# EAGLE design homecontroller_addon_PT1000 (EAGLE 6.6.0)
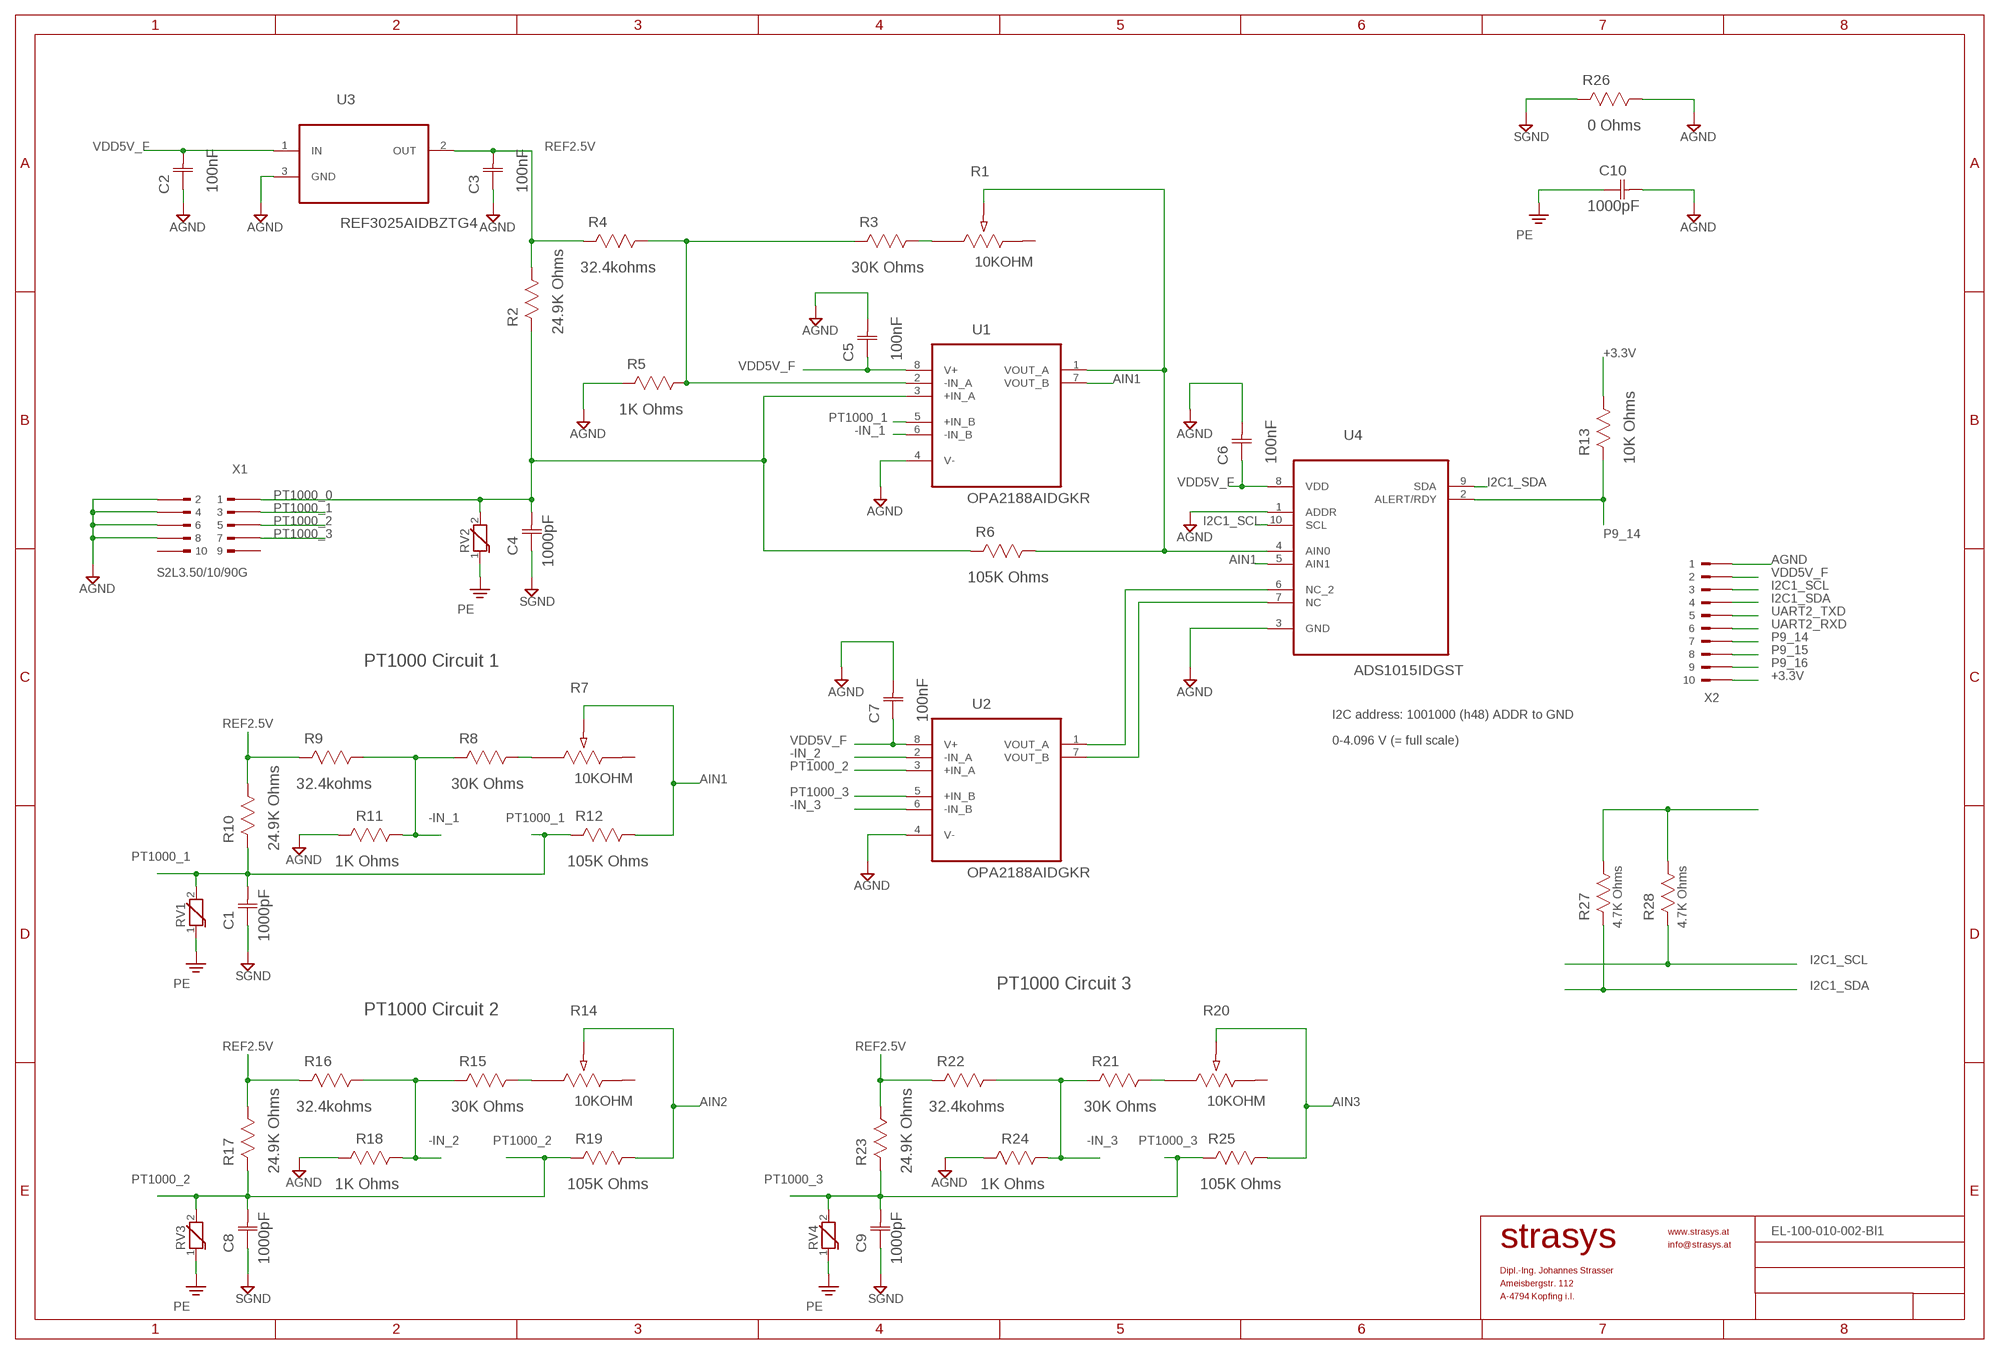
[diagram p0: schematic, sheet 1]
FRAME1 (STRASYS_DINA3_L): DATE_DRAWING: 02.09.2015 / STJO; DRAWING_NAME1: Home Controller; DRAWING_NAME2: PT1000 add on board; DRAWING_NO: EL-100-010-002-Bl1; PAGE: 1

## Parts
C1  1000pF  C1206C102KDRACTU  [CAPC3216X88N]
C2  100nF  C0805C104K5RACTU  [CAPC2013X110N]
C3  100nF  C0805C104K5RACTU  [CAPC2013X110N]
C4  1000pF  C1206C102KDRACTU  [CAPC3216X88N]
C5  100nF  C0805C104K5RACTU  [CAPC2013X110N]
C6  100nF  C0805C104K5RACTU  [CAPC2013X110N]
C7  100nF  C0805C104K5RACTU  [CAPC2013X110N]
C8  1000pF  C1206C102KDRACTU  [CAPC3216X88N]
C9  1000pF  C1206C102KDRACTU  [CAPC3216X88N]
C10  1000pF  C1206C102KDRACTU  [CAPC3216X88N]
R1  10KOHM  EVM3YSX50B14-3W  [POT_EVM3W]
R2  24.9K Ohms  CRCW080524K9FKEA  [RESC2013X65N]
R3  30K Ohms  CRCW080530K0FKEA  [RESC2013X65N]
R4  32.4kohms  ERJ6ENF3242V  [RESC2013X65N]
R5  1K Ohms  CRCW08051K00FKEA  [RESC2013X65N]
R6  105K Ohms  CRCW0805105KFKEA  [RESC2013X65N]
R7  10KOHM  EVM3YSX50B14-3W  [POT_EVM3W]
R8  30K Ohms  CRCW080530K0FKEA  [RESC2013X65N]
R9  32.4kohms  ERJ6ENF3242V  [RESC2013X65N]
R10  24.9K Ohms  CRCW080524K9FKEA  [RESC2013X65N]
R11  1K Ohms  CRCW08051K00FKEA  [RESC2013X65N]
R12  105K Ohms  CRCW0805105KFKEA  [RESC2013X65N]
R13  10K Ohms  CRCW080510K0JNEA  [RESC2013X65N]
R14  10KOHM  EVM3YSX50B14-3W  [POT_EVM3W]
R15  30K Ohms  CRCW080530K0FKEA  [RESC2013X65N]
R16  32.4kohms  ERJ6ENF3242V  [RESC2013X65N]
R17  24.9K Ohms  CRCW080524K9FKEA  [RESC2013X65N]
R18  1K Ohms  CRCW08051K00FKEA  [RESC2013X65N]
R19  105K Ohms  CRCW0805105KFKEA  [RESC2013X65N]
R20  10KOHM  EVM3YSX50B14-3W  [POT_EVM3W]
R21  30K Ohms  CRCW080530K0FKEA  [RESC2013X65N]
R22  32.4kohms  ERJ6ENF3242V  [RESC2013X65N]
R23  24.9K Ohms  CRCW080524K9FKEA  [RESC2013X65N]
R24  1K Ohms  CRCW08051K00FKEA  [RESC2013X65N]
R25  105K Ohms  CRCW0805105KFKEA  [RESC2013X65N]
R26  0 Ohms  CRCW12060000Z0EA  [RESC3216X71N]
R27  4.7K Ohms  CRCW08054K70FKEA  [RESC2013X65N]
R28  4.7K Ohms  CRCW08054K70FKEA  [RESC2013X65N]
RV1  MC-VZ-MCVZ0805M180AGT_0805  [WESURGE_0805]
RV2  MC-VZ-MCVZ0805M180AGT_0805  [WESURGE_0805]
RV3  MC-VZ-MCVZ0805M180AGT_0805  [WESURGE_0805]
RV4  MC-VZ-MCVZ0805M180AGT_0805  [WESURGE_0805]
U1  OPA2188AIDGKR  [SOP65P490X110-8N]
U2  OPA2188AIDGKR  [SOP65P490X110-8N]
U3  REF3025AIDBZTG4  [SOT95P237X112-3N]
U4  ADS1015IDGST  [SOP50P490X110-10N]
X1  S2L3.50/10/90G  [S2L-90G-10]
X2  CON-10X2MM  [2MM-10-THT]

## Nets
+3.3V: R13.1 R27.1 R28.1 X2.P$10
-IN_0: R3.2 R4.1 R5.1 U1.2(-IN_A)
-IN_1: R8.2 R9.1 R11.1 U1.6(-IN_B)
-IN_2: R15.2 R16.1 R18.1 U2.2(-IN_A)
-IN_3: R21.2 R22.1 R24.1 U2.6(-IN_B)
AGND: C2.1(C1) C3.1(C1) C5.2(C2) C6.2(C2) C7.2(C2) C10.2(C2) R5.2 R11.2 R18.2 R24.2 R26.1 U1.4(V-) U2.4(V-) U3.3(GND) U4.1(ADDR) U4.3(GND) X1.2 X1.4 X1.6 X1.8 X2.P$1
AIN0: R1.2 R6.1 U1.1(VOUT_A) U4.4(AIN0)
AIN1: R7.2 R12.1 U1.7(VOUT_B) U4.5(AIN1)
AIN2: R14.2 R19.1 U2.1(VOUT_A) U4.6(NC_2)
AIN3: R20.2 R25.1 U2.7(VOUT_B) U4.7(NC)
I2C1_SCL: R28.2 U4.10(SCL) X2.P$3
I2C1_SDA: R27.2 U4.9(SDA) X2.P$4
N$2: R14.1 R15.1
N$3: R7.1 R8.1
N$4: R20.1 R21.1
N$6: R1.1 R3.1
P9_14: R13.2 U4.2(ALERT/RDY) X2.P$7
P9_15: X2.P$8
P9_16: X2.P$9
PE: C10.1(C1) RV1.1 RV2.1 RV3.1 RV4.1
PT1000_0: C4.2(C2) R2.2 R6.2 RV2.2 U1.3(+IN_A) X1.1
PT1000_1: C1.2(C2) R10.2 R12.2 RV1.2 U1.5(+IN_B) X1.3
PT1000_2: C8.2(C2) R17.2 R19.2 RV3.2 U2.3(+IN_A) X1.5
PT1000_3: C9.2(C2) R23.2 R25.2 RV4.2 U2.5(+IN_B) X1.7
REF2.5V: C3.2(C2) R2.1 R4.2 R9.2 R10.1 R16.2 R17.1 R22.2 R23.1 U3.2(OUT)
SGND: C1.1(C1) C4.1(C1) C8.1(C1) C9.1(C1) R26.2
UART2_RXD: X2.P$6
UART2_TXD: X2.P$5
VDD5V_F: C2.2(C2) C5.1(C1) C6.1(C1) C7.1(C1) U1.8(V+) U2.8(V+) U3.1(IN) U4.8(VDD) X2.P$2
Unconnected: R1.3 R7.3 R14.3 R20.3 X1.9 X1.10

## Notes on the sheet
- PT1000 Circuit 1
- I2C address: 1001000 (h48) ADDR to GND
- 0-4.096 V (= full scale)
- PT1000 Circuit 3
- PT1000 Circuit 2

## Library data of the parts
C1 C4 C8-C10 = supply2:C1206C102KDRACTU: Capacitor 1206; MF: KEMET; MPN: C1206C102KDRACTU; OC_FARNELL: 1826304; SUPPLIER: Kemet; TOLERANCE: +/- 10%; VOLTAGE_RATING: 1000V
C2 C3 C5-C7 = Kemet_By_element14_1:C0805C104K5RACTU: CAPACITOR, 0805; MF: KEMET; MPN: C0805C104K5RACTU; OC_FARNELL: 1414664; OC_NEWARK: 65H7431; SUPPLIER: Kemet; TOLERANCE: ±10%; VOLTAGERATING: 50V
R1 R7 R14 R20 = Panasonic-Trimmer_Potentiometers:EVM: Potentiometers; MF: PANASONIC ELECTRONIC COMPONENTS; MPN: EVM3YSX50B14; OC_FARNELL: 1849801; OC_NEWARK: 48W0124; PACKAGE: EVM3Y; POWERRATING: 0.15W; SUPPLIER: PANASONIC; TOLERANCE: ±25 %
R2 R10 R17 R23 = Vishay_By_element14_Batch_1:CRCW080524K9FKEA: RESISTOR, 0805; MF: VISHAY DRALORIC; MPN: CRCW080524K9FKEA; OC_FARNELL: 1469901; OC_NEWARK: 53K0043; SUPPLIER: Vishay; TOLERANCE: ±1%; WATTAGE: 0.125 W
R3 R8 R15 R21 = Vishay_By_element14_Batch_1:CRCW080530K0FKEA: RESISTOR, 0805; MF: VISHAY DRALORIC; MPN: CRCW080530K0FKEA; OC_FARNELL: 1469914; OC_NEWARK: 53K0136; SUPPLIER: Vishay; TOLERANCE: ±1%; WATTAGE: 0.125 W
R4 R9 R16 R22 = Vishay_By_element14_Batch_1:ERJ6ENF3242V: RESISTOR, 0805; MF: PANASONIC ELECTRONIC COMPONENTS; MPN: ERJ6ENF3242V; OC_FARNELL: 2303704; SUPPLIER: PANASONIC ELECTRONIC COMPONENTS; TOLERANCE: +/- 1%; WATTAGE: 0.125 W
R5 R11 R18 R24 = Vishay_By_element14_Batch_1:CRCW08051K00FKEA: RESISTOR, 0805; MF: VISHAY DRALORIC; MPN: CRCW08051K00FKEA; OC_FARNELL: 1469847; OC_NEWARK: 52K9723; SUPPLIER: Vishay; TOLERANCE: ±1%; WATTAGE: 0.125 W
R6 R12 R19 R25 = Vishay_By_element14_Batch_1:CRCW0805105KFKEA: RESISTOR, 0805; MF: VISHAY DRALORIC; MPN: CRCW0805105KFKEA; OC_FARNELL: 1652908; OC_NEWARK: 52K9813; SUPPLIER: Vishay; TOLERANCE: ±1%; WATTAGE: 0.125 W
R13 = Vishay_By_element14_Batch_1:CRCW080510K0JNEA: RESISTOR, 0805; MF: VISHAY DRALORIC; MPN: CRCW080510K0JNEA; OC_FARNELL: 1469857; OC_NEWARK: 52K9797; SUPPLIER: Vishay; TOLERANCE: ±5%; WATTAGE: 0.125 W
R26 = Vishay_By_element14_Batch_1:CRCW12060000Z0EA: RESISTOR, 1206; MF: VISHAY DRALORIC; MPN: CRCW12060000Z0EA; OC_FARNELL: 1469963; OC_NEWARK: 53K1778; SUPPLIER: Vishay; TOLERANCE: -; WATTAGE: 0.25W
R27 R28 = Vishay_By_element14_Batch_1:CRCW08054K70FKEA: RESISTOR, 0805; MPN: CRCW08054K70FKEA; OC_FARNELL: 1469923; OC_NEWARK: 53K0215; SUPPLIER: Vishay; TOLERANCE: ±1%; WATTAGE: 0.125 W
RV1-RV4 = WE-VS:MC-VZ: SMD Varistor ESD Protection for components sensitive to IEC 61000-4-2, Provides Circuit Board Transient Voltage Protection for Transistors Protection of Video and Audio Ports; MF: MULTICOMP; MPN: MCVZ0805M180AGT; OC_FARNELL: 1856938; PACKAGE: 0805; SUPPLIER: MULTICOMP
U1 U2 = strasys_standard:OPA2188AIDGKR: OP AMP, GP, RR, 2MHZ, 36-V, Zero-Drift,8MSOP; MF: TEXAS INSTRUMENTS; MPN: OPA2188AIDGKR; OC_FARNELL: 2057091; OC_NEWARK: 61T5955; PACKAGE: 8MSOP; SUPPLIER: TEXAS INSTRUMENTS
U3 = strasys_standard:REF3025AIDBZTG4: CMOS VOLTAGE REFERENCE; MF: TEXAS INSTRUMENTS; MPN: REF3025AIDBZTG4; OC_FARNELL: 1234684; OC_NEWARK: 13M5187; PACKAGE: SOT-23-3; SUPPLIER: TEXAS INSTRUMENTS
U4 = ADS1015:ADS1015IDGST: Ultra-Small, Low-Power, 12-Bit Analog-to-Digital Converter with Internal Reference; MF: TEXAS INSTRUMENTS; MPN: ADS1015IDGST; OC_FARNELL: 1778211; OC_NEWARK: 35R0211; PACKAGE: MSOP-10; SUPPLIER: Texas Instruments
X1 = strasys_standard:S2L3.50/10/90G: OMNIMATE S2L3.50/10/90G Fa. Weidmüller; OC_FARNELL: unknown; SUPPLIER: Weidmüller
X2 = strasys_standard:CON-10X2MM: THT pin connector male pitch: 2mm; OC_FARNELL: unknown

## Net classes
0 default: clearance 0.205 mm

## Board
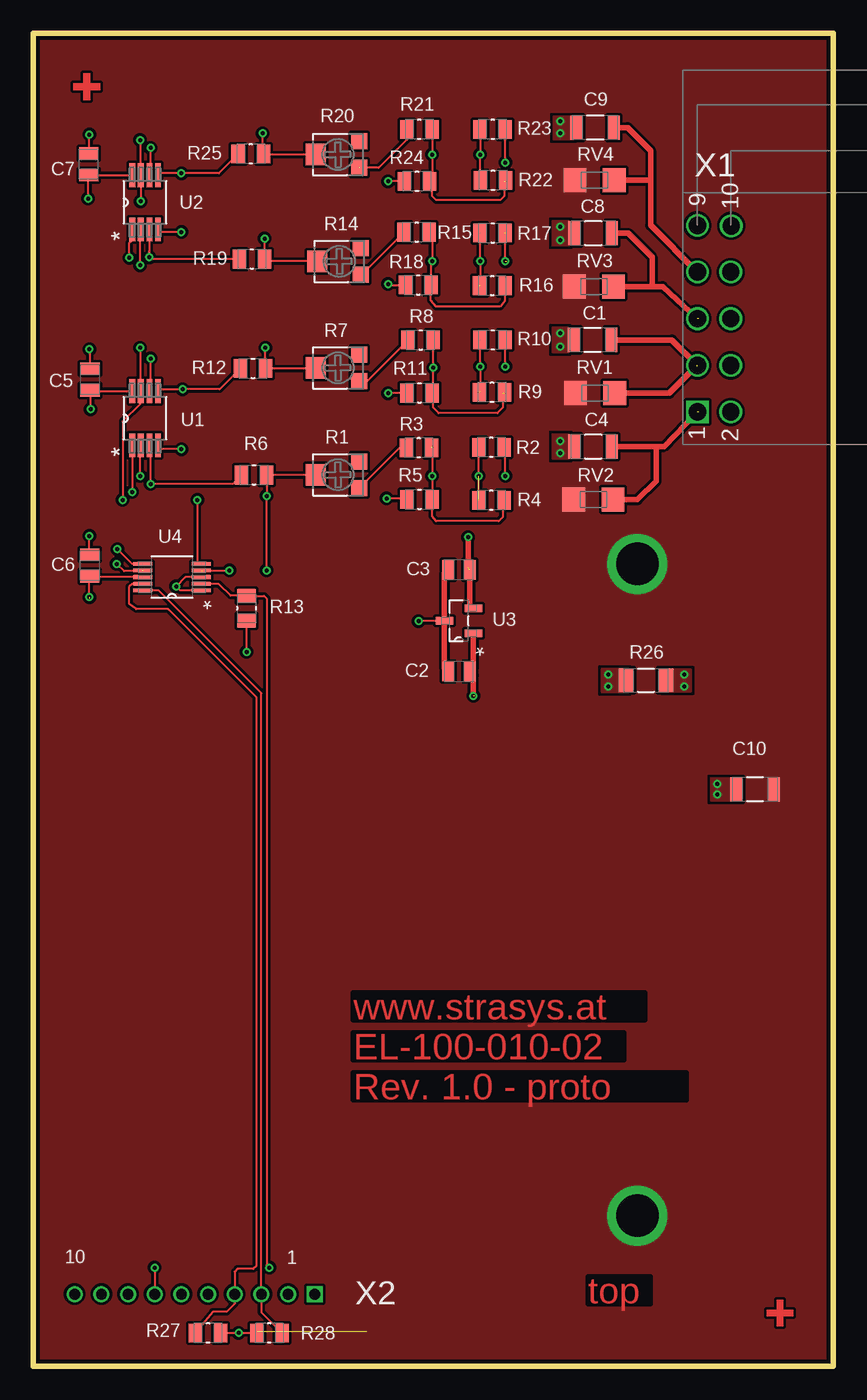
[diagram p1: board, top side]
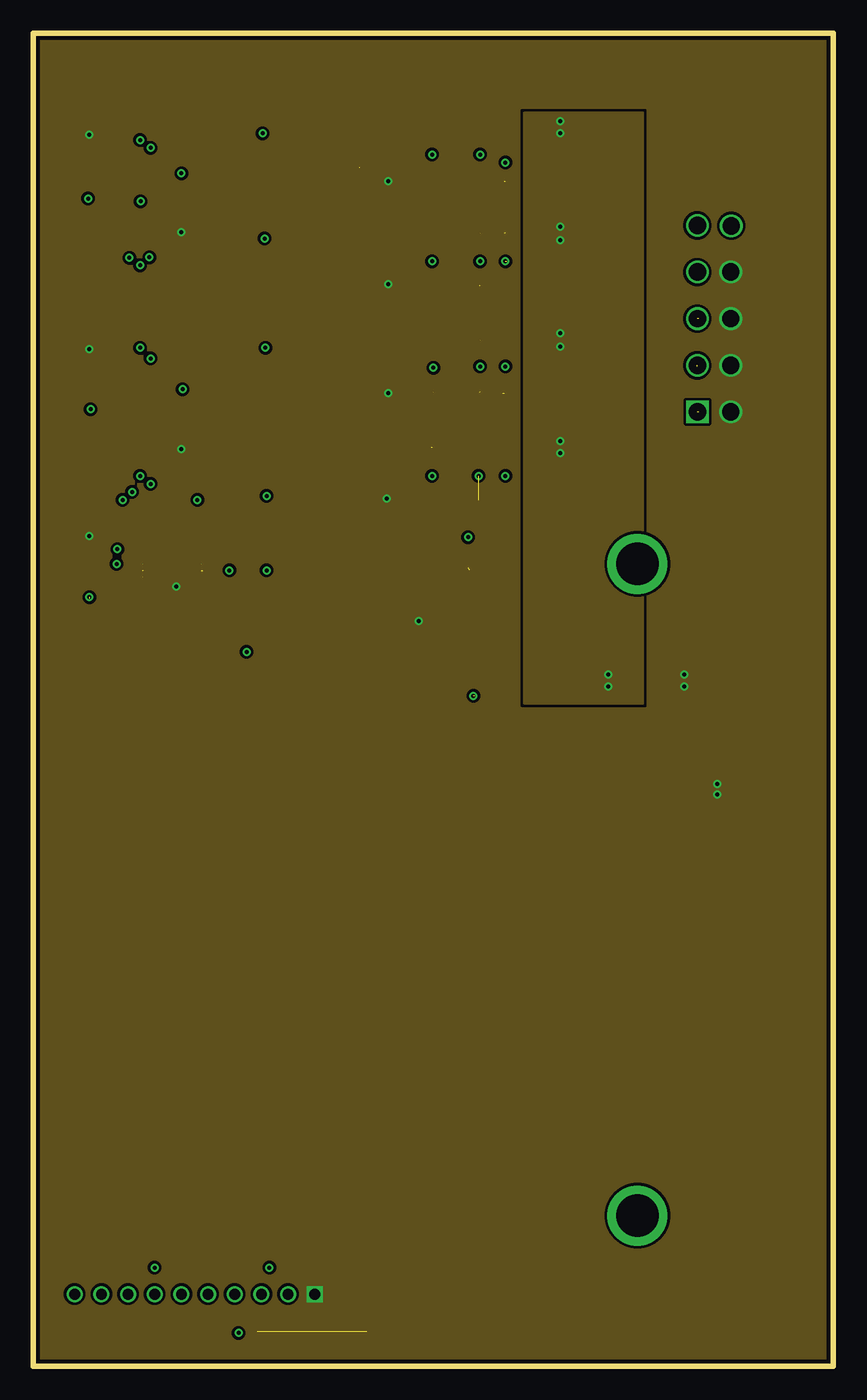
[diagram p2: board, inner layer Route2]
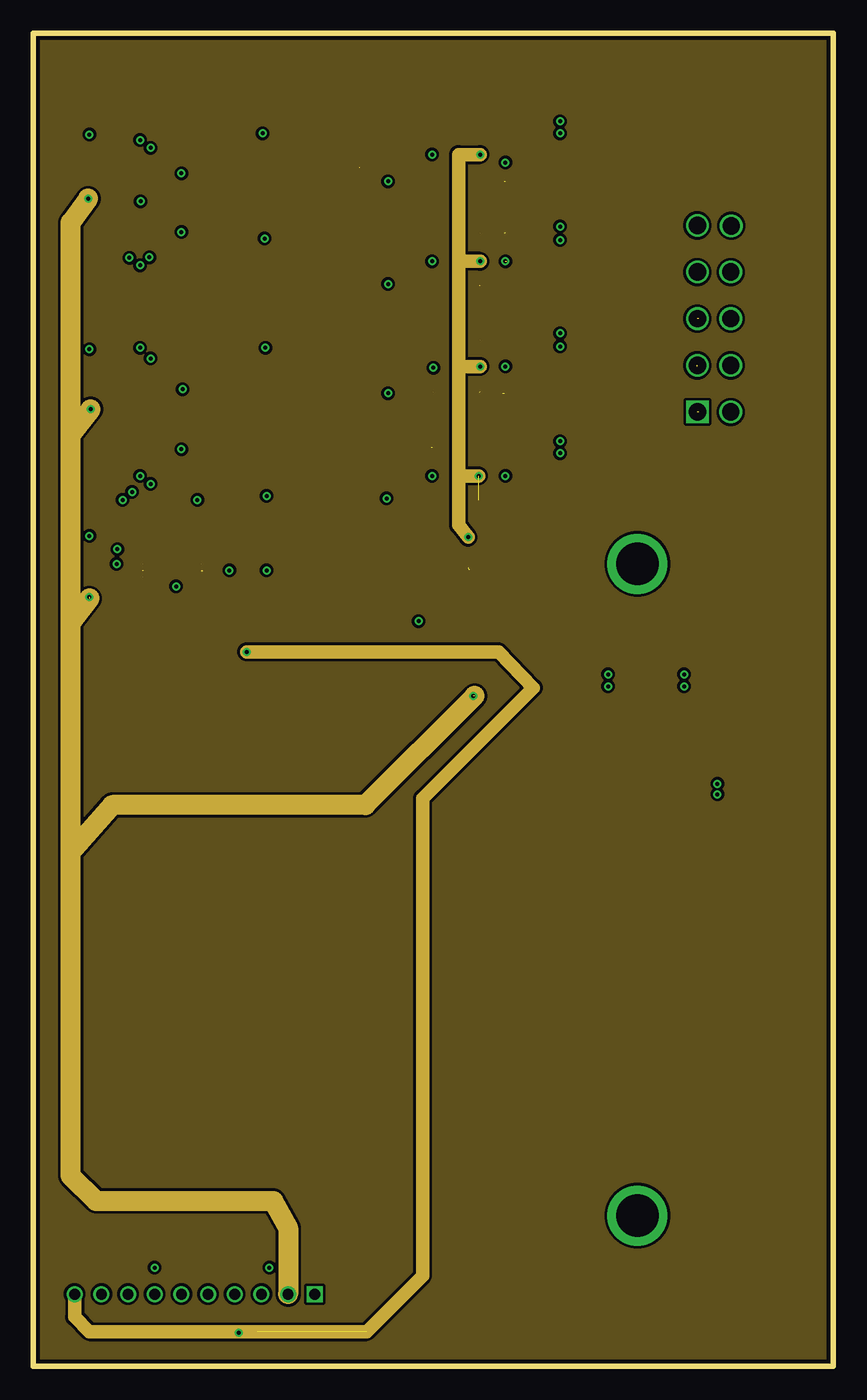
[diagram p3: board, inner layer Route15]
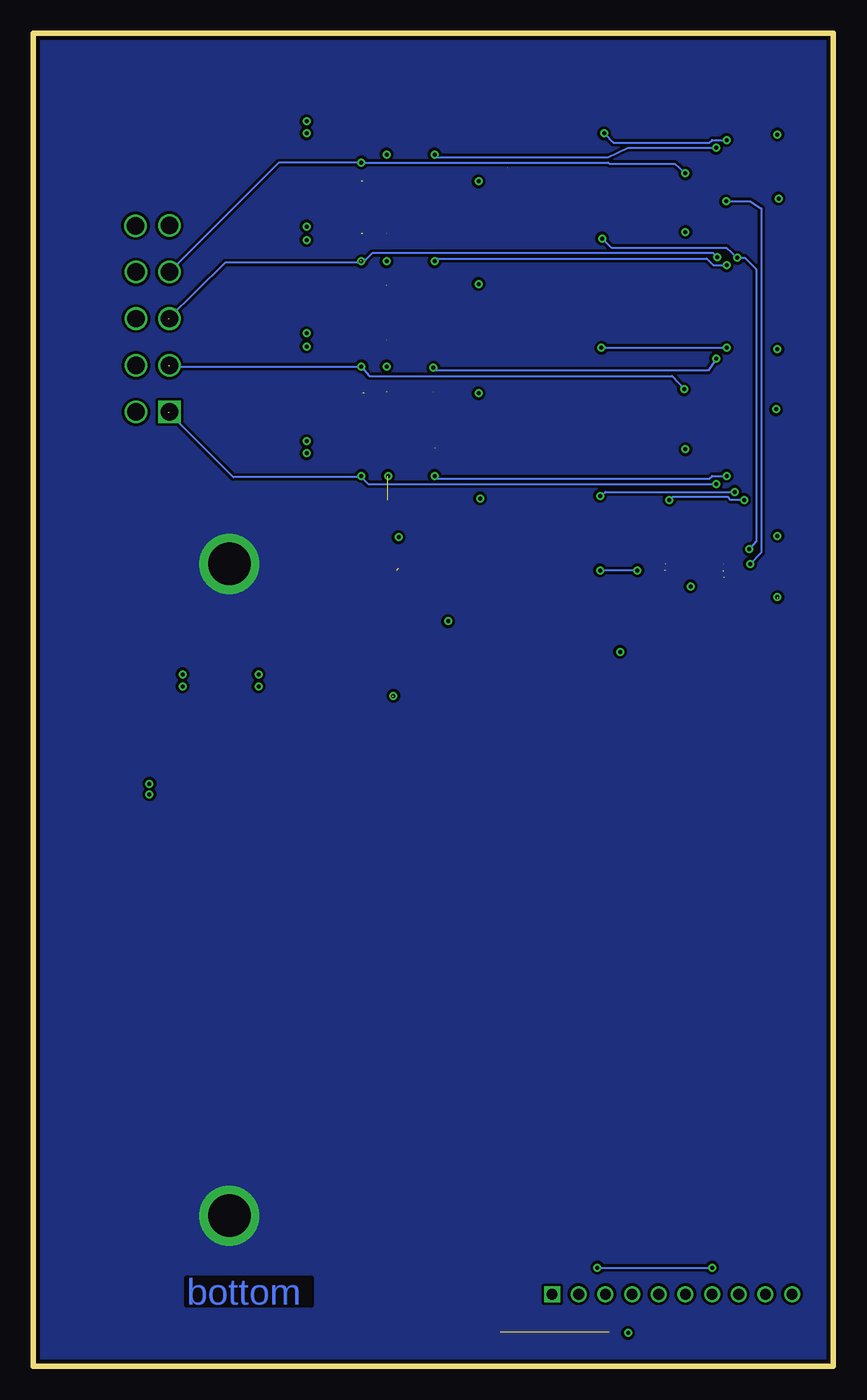
[diagram p4: board, bottom side, seen from below]

Size 60 x 100 mm. Coordinates in mm from the lower left corner, seen from the top.
Outline: 0,0 0,100 60,100 60,0 0,0
Copper layers (1+2*15+16): Top 0.035mm / dielectric 0.38mm / Route2 0.035mm / dielectric 0.71mm / Route15 0.035mm / dielectric 0.38mm / Bottom 0.035mm
Design rules "PCB-POOL Standard_ML4": minimum track width 0.15mm, minimum drill 0.3mm, track to track 0.15mm, track to pad 0.15mm, pad to pad 0.15mm, via to via 0.15mm, smd to smd 0.15mm, copper to edge 0.3mm, drill to drill 0.2mm, minimum pad ring 0.2mm, minimum via ring 0.15mm, stop-mask expansion 0.075mm, vias tented up to drill 0mil, thermal gap 0.2mm

### Footprints (pad centres in the part's own frame; a part is rotated, then mirrored left to right if it is on the bottom)
CAPC3216X88N = smd 0.914 x 1.803: 1 -1.397,0; 2 1.397,0
CAPC2013X110N = smd 0.914 x 1.448: 1 -0.813,0; 2 0.813,0
POT_EVM3W = smd 1.194 x 1.194: 1 -0.991,-1.6; 3 0.991,-1.6 | smd 1.6 x 1.499: 2 0,1.651
RESC2013X65N = smd 1.016 x 1.397: 1 -0.94,0; 2 0.94,0
RESC3216X71N = smd 1.118 x 1.753: 1 -1.473,0; 2 1.473,0
WESURGE_0805 = smd 1.7 x 1.8: 1 -1.475,0; 2 1.475,0
SOP65P490X110-8N = smd 1.778 x 0.432: 1 -2.032,0.965; 2 -2.032,0.33; 3 -2.032,-0.33; 4 -2.032,-0.965; 5 2.032,-0.965; 6 2.032,-0.33; 7 2.032,0.33; 8 2.032,0.965
SOT95P237X112-3N = smd 1.321 x 0.559: 1 -1.092,0.94; 2 -1.092,-0.94; 3 1.092,0
SOP50P490X110-10N = smd 1.422 x 0.279: 1 -2.184,0.991; 2 -2.184,0.508; 3 -2.184,0; 4 -2.184,-0.508; 5 -2.184,-0.991; 6 2.184,-0.991; 7 2.184,-0.508; 8 2.184,0; 9 2.184,0.508; 10 2.184,0.991
S2L-90G-10 = drill 1.3 square: 1 0,0 | drill 1.3: 2 0,-2.5; 3 3.5,0; 4 3.5,-2.5; 5 7,0; 6 7,-2.5; 7 10.5,0; 8 10.5,-2.5; 9 14,0; 10 13.97,-2.54
2MM-10-THT = drill 0.8 square: P$1 0,0 | drill 0.8: P$2 2,0; P$3 4,0; P$4 6,0; P$5 8,0; P$6 10,0; P$7 12,0; P$8 14,0; P$9 16,0; P$10 18,0

### Placement (x,y rotation side)
C1  41.94,77 0 top
C2  31.92,52.12 0 top
C3  31.92,59.74 0 top
C4  41.99,69 0 top
C5  4.24,74.02 90 top
C6  4.23,60.08 90 top
C7  4.15,90.17 90 top
C8  41.99,85 0 top
C9  42.14,92.93 0 top
C10  54.13,43.28 180 top
R1  22.85,66.88 90 top
R2  34.35,68.95 0 top
R3  28.91,68.91 0 top
R4  34.35,64.97 180 top
R5  28.97,65.03 180 top
R6  16.55,66.86 180 top
R7  22.85,74.9 90 top
R8  29.05,76.99 0 top
R9  34.4,73.07 180 top
R10  34.45,77 0 top
R11  28.97,73.01 180 top
R12  16.47,74.86 180 top
R13  16,56.87 90 top
R14  22.95,82.89 90 top
R15  28.75,85.08 0 top
R16  34.42,81.07 180 top
R17  34.45,85.02 0 top
R18  28.87,81.12 180 top
R19  16.39,83.06 180 top
R20  22.85,90.91 90 top
R21  28.95,92.8 0 top
R22  34.47,88.97 180 top
R23  34.45,92.8 0 top
R24  28.77,88.9 180 top
R25  16.31,90.96 180 top
R26  45.95,51.45 180 top
R27  13.1,2.5 180 top
R28  17.7,2.5 0 top
RV1  42.13,73 0 top
RV2  42.01,65.01 0 top
RV3  42.04,80.99 0 top
RV4  42.09,88.99 0 top
U1  8.38,71.12 90 top
U2  8.38,87.32 90 top
U3  31.92,55.93 180 top
U4  10.4,59.2 180 top
U$1  [PASSER_SMD4]  56,4 0 top
U$2  [PASSER_SMD4]  4,96 0 top
X1  49.8,71.59 90 top
X2  21.1,5.4 180 top

### Tracks (layer width: path | path; a pad name or v marks a point on that pad's centre or on a via)
+3.3V  (via drill 0.3)  (1 unrouted)
  Top 0.15: v16,53.6 R13.1 | R27.1 v15.4,2.5 R28.1 16.76,2.56 16.8,2.6
  Route15 1: X2.P$10 3.1,3.7 4.2,2.6 25,2.6 29.2,6.8 29.2,42.6 37.5,50.9 34.9,53.6 v16,53.6
-IN_0  (via drill 0.3)  (1 unrouted)
  Top 0.15: v8,66.8 8,69 U1.2 | v29.9,66.8 29.9,68.9 R5.1 29.91,63.79 30.2,63.4 34.9,63.4 35.2,63.7 35.2,64.88 R4.1
  Bottom 0.15: v8,66.8 9.1,66.8 9.3,66.6 29.7,66.6 v29.9,66.8
-IN_1  (via drill 0.3)  (2 unrouted)
  Top 0.15: R11.1 29.99,73.09 v29.99,74.9 | v29.99,74.9 R8.2 | R11.1 | 35.3,73 R9.1 | v30,74.9 v29.99,74.9 | 29.9,73.1 R11.1 | v8.8,75.6 8.8,73.6 8.7,73.5 8.7,73.2 U1.6 | 35.2,73 35.2,71.9 34.8,71.5 30.4,71.5 30,71.9 30,73.1
  Bottom 0.15: v30,74.9 29.8,74.7 9.4,74.7 v8.8,75.6
-IN_2  (via drill 0.3)
  Top 0.15: 35.4,81 R16.1 35.36,79.96 35,79.5 30.2,79.5 29.8,80 R18.1 | 29.9,81.1 R18.1 | v8,82.6 8,85.2 U2.2 | R15.2 29.9,85 v29.9,82.9 29.81,82.9 R18.1
  Bottom 0.15: v8,82.6 9,82.6 9.5,83.1 29.7,83.1 v29.9,82.9
-IN_3  (via drill 0.3)  (1 unrouted)
  Top 0.15: 29.9,89 v29.9,90.9 R21.2 | 29.9,89 R24.1 29.71,88.49 | 35.4,88.9 R22.1 | 8.8,91.6 v8.8,91.4 8.8,89.8 8.7,89.7 8.7,89.4 U2.6 | 35.3,88.9 35.3,87.8 35,87.5 30.2,87.5 29.9,87.8 29.9,89
  Bottom 0.15: v8.8,91.4 15.4,91.4 16.9,90.7 29.7,90.7 v29.9,90.9
AGND  (via drill 0.3)
  Top 0.15: C3.1 30.83,59.46 | 30.83,52.4 C2.1 | v26.6,88.9 27.7,88.9 27.8,89 27.9,88.9 R24.2 | v11.1,85.1 9.35,85.1 U2.4 | C7.2 4.2,91.23 v4.2,92.4 | v26.6,81.2 26.52,81.12 R18.2 | v4.2,76.3 4.24,76.26 C5.2 | v28.9,55.9 30.7,55.9 U3.3 | v26.6,73 27.9,73 28,72.9 28.1,73 R11.2 | v26.5,65.1 27.9,65.1 28,65.2 28.1,65.1 R5.2 | v11.1,68.8 9.35,68.8 U1.4 | C6.2 4.2,60.92 v4.2,62.3 | U4.1 12.5,58.2 11,58.2 v10.7,58.5 11.4,59.2 U4.3
  Top 0.4: 30.83,59.46 U3.3 30.83,52.4
  other vias: 48.8,51.9 48.8,51 51.3,43.7 51.3,42.9
  pour Route2 (rank 3, no thermals): 0,100 60,100 60,0 0,0
  pour Top (no thermals): 47.3,52.3 49.3,52.3 49.3,50.6 47.3,50.6
  pour Top (no thermals): 52.3,44.1 50.8,44.1 50.8,42.45 52.3,42.45
AIN0  (via drill 0.3)  (1 unrouted)
  Top 0.15: R1.2 21.18,66.86 R6.1 17.5,66.8 v17.5,65.3 v17.5,59.7 | v7.4,65.6 7.4,69 U1.1 | 12.7,59.7 v14.7,59.7
  Bottom 0.15: v7.4,65.6 17.1,65.6 v17.5,65.3 | v14.7,59.7 v17.5,59.7
AIN1  (via drill 0.3)  (1 unrouted)
  Top 0.15: v8,76.4 8,73.2 U1.7 8,73.1 8,72.2 6.7,70.9 v6.7,65 | v17.4,76.4 17.4,74.9 R12.1 21.16,74.86 R7.2 | 12.6,60.2 12.3,60.2 v12.3,65
  Bottom 0.15: v17.4,76.4 v8,76.4 | v12.3,65 12.1,65.2 7.9,65.2 7.7,65 v6.7,65
AIN2  (via drill 0.3)  (1 unrouted)
  Top 0.15: R14.2 17.33,82.89 R19.1 17.35,83.1 v17.35,84.6 | 7.4,85.25 U2.1 7.4,85.2 7.4,84.5 7.2,84.3 v7.2,83.15 | v6.3,61.3 7.4,60.2 8.21,60.2
  Bottom 0.15: v17.35,84.6 16.65,83.9 8.05,83.9 v7.2,83.15 6.65,83.15 5.8,82.3 5.8,61.9 v6.3,61.3
AIN3  (via drill 0.3)  (1 unrouted)
  Top 0.15: R20.2 17.3,90.91 R25.1 17.2,91 v17.2,92.5 | v8,92 8,89.4 U2.7 8.05,89.3 v8.05,87.4 | v6.25,60.2 6.8,59.65 8.25,59.65
  Bottom 0.15: v8,92 9.1,92 9.3,91.8 16.5,91.8 v17.2,92.5 | v8.05,87.4 6.25,87.4 5.4,86.85 5.4,61.05 v6.25,60.2
I2C1_SCL
  Top 0.15: U4.10 9.4,58.2 17.1,50.5 X2.P$3 17.1,4.04 R28.2
I2C1_SDA
  Top 0.15: U4.9 8.2,58.7 7.4,58.7 7.2,58.5 7.2,57.2 7.7,56.8 10.1,56.8 16.7,50.2 16.7,7.5 16.5,7.3 15.3,7.3 15.1,7.1 X2.P$4 15.1,4.7 14.5,4.1 13.46,4.1 R27.2
N$2
  Top 0.15: R15.1 24.63,81.9 R14.1
N$3
  Top 0.15: R8.1 25.03,73.91 R7.1
N$4  (1 unrouted)
  Top 0.15: R21.1 28.01,92.01 25.9,89.9 24.47,89.9
N$6
  Top 0.15: R3.1 27.47,68.91 R1.1
N$8
  pour Route15: 0,100 60,100 60,0 0,0
P9_14  (via drill 0.3)
  Top 0.15: v9.1,7.4 X2.P$7 | v17.7,7.4 17.5,7.6 17.5,57.6 17.3,57.8 R13.2 14.79,57.81 13.9,58.7 12.59,58.7 U4.2
  Bottom 0.15: v17.7,7.4 v9.1,7.4
PE  (via drill 3.2 pad 4.5)
  other vias: 45.3,11.3 45.3,60.2
  pour Top (rank 4, no thermals): 0,100 60,100 60,0 0,0
  pour Bottom: 0,100 60,100 60,0 0,0
PT1000_0  (via drill 0.3)  (1 unrouted)
  Top 0.15: v35.4,66.8 35.4,68.84 R2.2 | U1.3 8.8,69 v8.8,66.2 14.95,66.2 R6.2
  Top 0.4: RV2.2 45.31,65.01 46.7,66.4 46.7,68.99 47.31,69 | 47.31,69 X1.1 | C4.2 47.31,69
  Bottom 0.15: 49.8,71.8 49.9,71.7 49.9,71.6 45,66.7 35.5,66.7 v35.4,66.8 35.4,66.7 34.9,66.2 v8.8,66.2
PT1000_1  (via drill 0.3)  (1 unrouted)
  Top 0.15: v35.4,75 35.39,74.9 R10.2 | U1.5 9.4,73.2 9.5,73.3 v11.2,73.3 13.97,73.3 R12.2
  Top 0.4: C1.2 47.89,77 X1.3 47.71,73 RV1.2
  Bottom 0.15: 49.8,75 v35.4,75 34.8,74.3 12.1,74.3 v11.2,73.3
PT1000_2  (via drill 0.3)  (3 unrouted)
  Top 0.15: v35.4,82.9 35.4,84.9 35.3,85 | v8.7,83.2 8.7,83.7 | v8.7,83.2 8.7,85.2 U2.3 | R19.2 8.7,83.06 v8.7,83.2
  Top 0.4: C8.2 44.6,85 46.4,83.2 46.4,80.99 | X1.5 47.2,81 46.4,80.99 | RV3.2 46.4,80.99
  Bottom 0.15: 35.5,82.9 35.3,82.8 | 35.3,82.8 45.6,82.8 49.9,78.6 | 35.3,82.8 34.6,83.5 9,83.5 v8.7,83.2
PT1000_3  (via drill 0.3)
  Top 0.15: R25.2 13.91,89.5 v11.1,89.5 9.35,89.5 U2.5 | R23.2 v35.4,90.3
  Top 0.4: C9.2 44.57,92.93 46.3,91.2 46.3,89 | 46.3,89 46.3,85.59 X1.7 | RV4.2 43.51,88.99 46.3,89
  Bottom 0.15: v11.1,89.5 11.9,90.2 16.8,90.2 16.9,90.3 v35.4,90.3 41.59,90.3 X1.7
REF2.5V  (via drill 0.3)  (6 unrouted)
  Top 0.15: R4.2 R2.1 | 32.73,57.15 U3.2 | R23.1 v33.5,90.9 33.5,88.97 R22.2 | R10.1 v33.5,75 33.5,73.11 | 33.5,81.09 v33.5,82.9 33.5,85 | v33.41,66.79 v33.4,66.8
  Top 0.4: C3.2 32.73,57.15 | v32.6,62.2 32.6,59.87
  Route15 1: v32.6,62.2 31.9,63.1 31.9,66.8 | 31.9,66.8 31.9,75 | 31.9,75 31.9,82.9 | 31.9,82.9 31.9,90.9 v33.5,90.9 | v33.5,75 31.9,75 | v33.5,82.9 31.9,82.9 | v33.4,66.8 31.9,66.8
SGND  (via drill 0.3)
  other vias: 39.5,92.5 39.5,93.4 39.5,85.5 39.5,84.5 39.5,77.5 39.5,76.5 39.5,69.4 39.5,68.5 43.1,51.9 43.1,51
  pour Route2 (isolate 0.15): 36.83,94.08 45.72,94.08 45.72,49.69 36.83,49.69
  pour Top (isolate 0.15, no thermals): 40.5,93.75 39,93.75 39,92.05 40.5,92.05
  pour Top (isolate 0.15, no thermals): 40.2,85.9 38.9,85.9 38.9,84.1 40.2,84.1
  pour Top (isolate 0.15, no thermals): 40.1,77.9 38.9,77.9 38.9,76.1 40.1,76.1
  pour Top (isolate 0.15, no thermals): 40.2,69.9 38.9,69.9 38.9,68.1 40.2,68.1
  pour Top (no thermals): 44.6,52.3 42.6,52.3 42.6,50.6 44.6,50.6
VDD5V_F  (via drill 0.3)  (3 unrouted)
  Top 0.15: 33.01,52.4 C2.2 | U2.8 3.96,89.35 C7.1 4.1,89.31 v4.1,87.6 | U1.8 4.29,73.15 C5.1 4.3,73.15 v4.3,71.8 | 8.2,59.2 4,59.2 C6.1 4.2,59.24 v4.2,57.7
  Top 0.4: U3.1 33.01,52.4 | v33,50.3 33,51.85 C2.2
  Route15 1.5: 2.8,38.6 2.8,14.3 4.7,12.4 18,12.4 19.1,10.4 X2.P$2 | 2.8,38.6 2.8,55.8 | 2.8,55.8 2.8,69.9 | 2.8,69.9 2.8,85.8 v4.1,87.6 | 4.2,57.6 2.8,55.8 | v4.3,71.8 2.8,69.9 | 33.1,50.3 24.9,42.1 5.9,42.1 2.8,38.6

### Text on the board
Top: www.strasys.at | EL-100-010-02 | Rev. 1.0 - proto | top
Bottom: bottom
tNames: 10 | 1